# Altium schematic sheet SAMV71.SchDoc: =ProjectTitle
size B; SheetNumber: 3; SheetTotal: 5
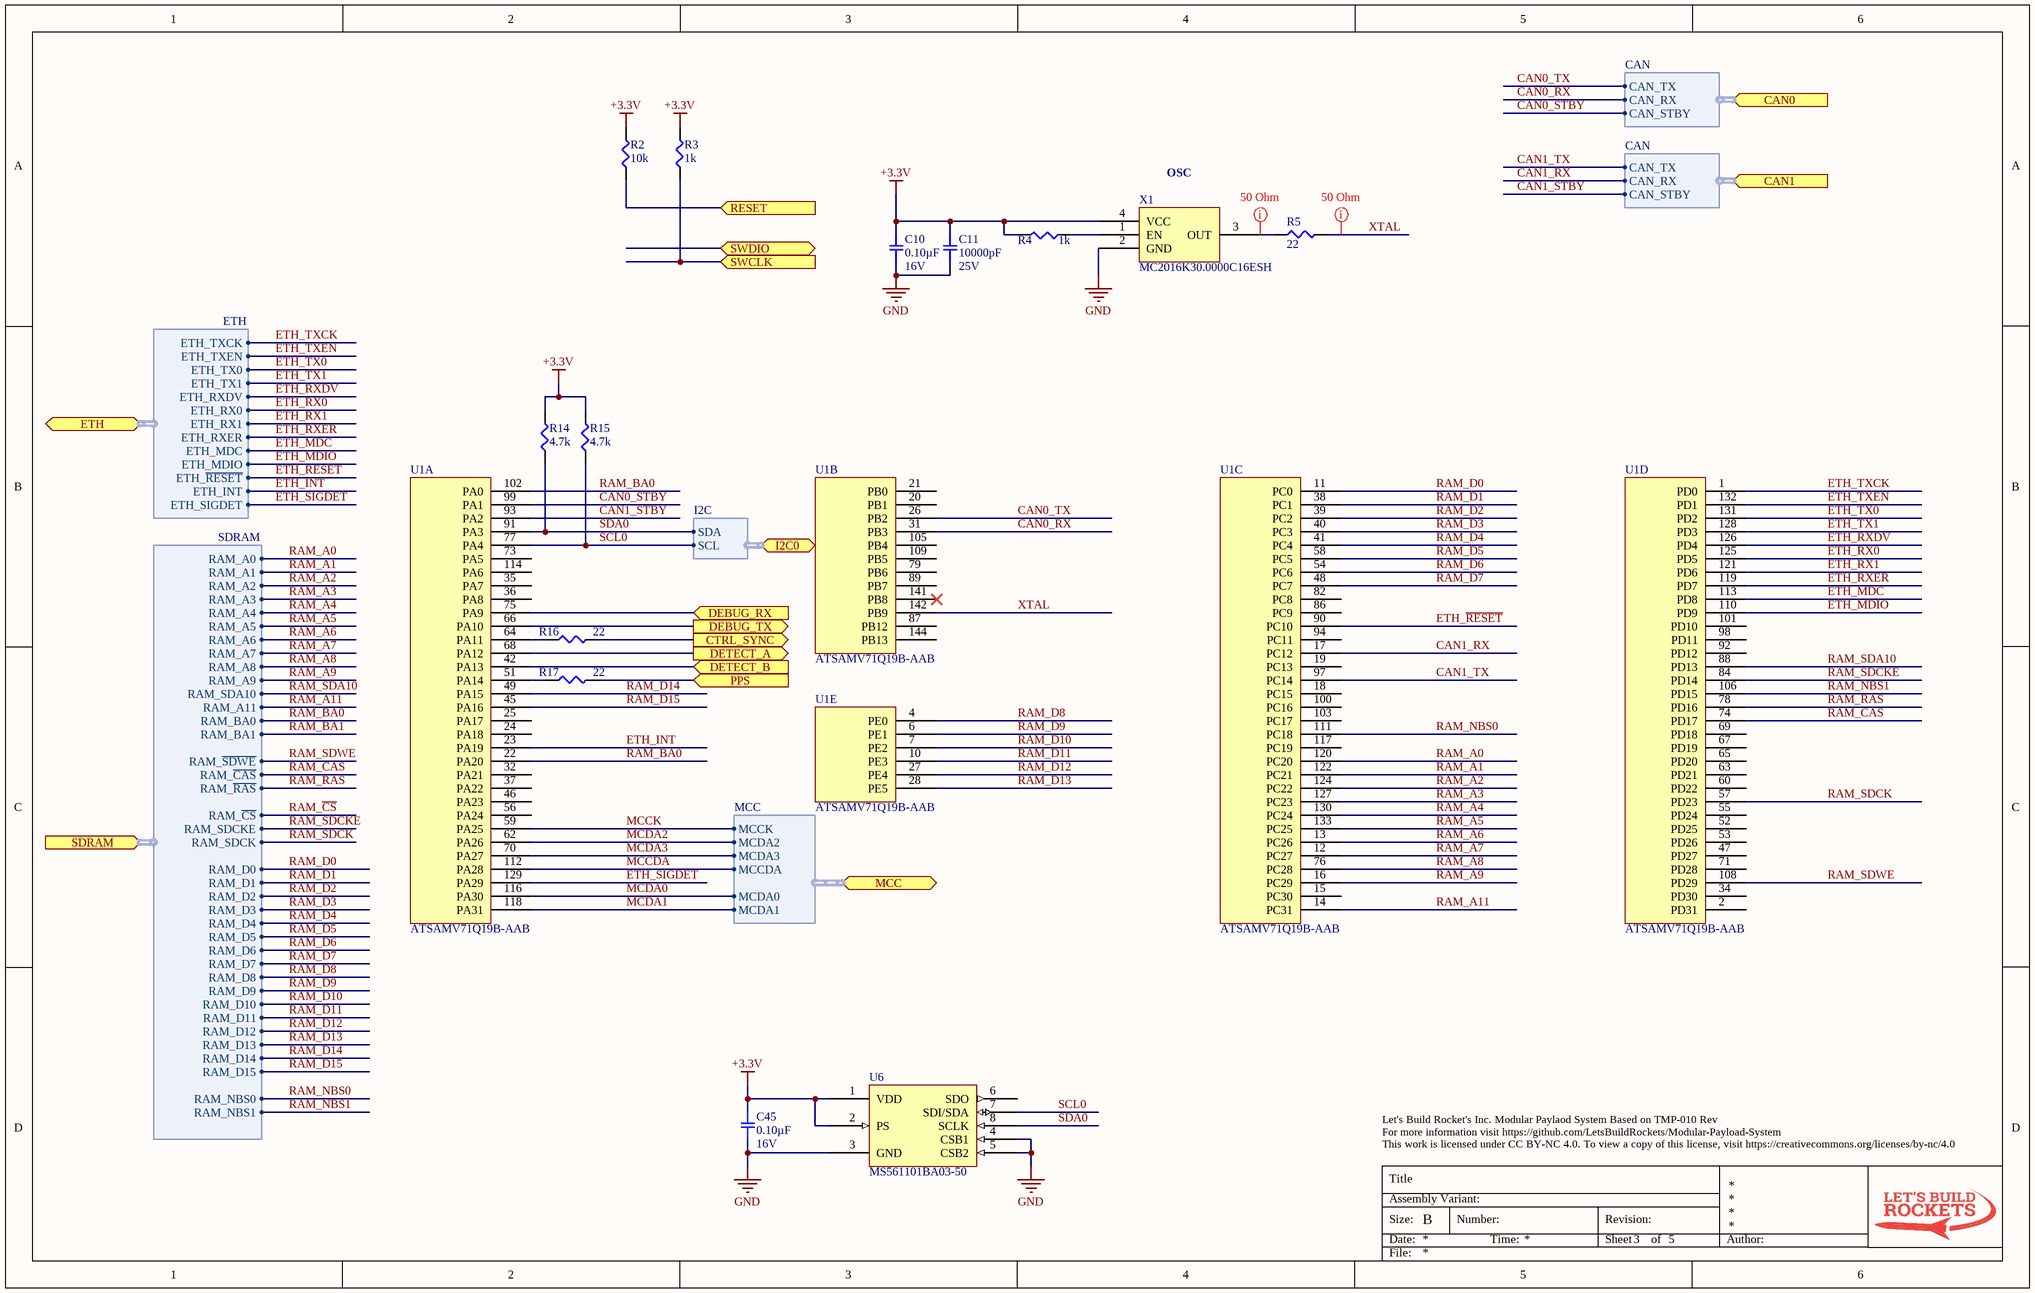
[diagram p0: SAMV71.SchDoc]

## Parts
C10  0.10µF  Voltage: 16V  [SMD-0402C]
C11  10000pF  Voltage: 25V  [SMD-0402C]
C45  0.10µF  Voltage: 16V  [SMD-0402C]
R2  10k  [SMD-0402-RES]
R3  1k  [SMD-0402-RES]
R4  1k  [SMD-0402-RES]
R5  22  [SMD-0402-RES]
R14  4.7k  [SMD-0402-RES]
R15  4.7k  [SMD-0402-RES]
R16  22  [SMD-0402-RES]
R17  22  [SMD-0402-RES]
U1  ATSAMV71Q19B-AAB  [TSQFP50P2200X2200X160-144N]  (parts A,B,C,D,E of 6)
U6  MS561101BA03-50  [MS561101BA03-50]
X1  MC2016K30.0000C16ESH  [MC2016]

## Ports
CAN0 (in, harness CAN), CAN1 (in, harness CAN), CTRL_SYNC (out), DEBUG_RX (in), DEBUG_TX (out), DETECT_A (out), DETECT_B (in), ETH (bidir, harness ETH), I2C0 (bidir, harness I2C), MCC (bidir, harness MCC), PPS (in), RESET (in), SDRAM (in, harness SDRAM), SWCLK (in), SWDIO (bidir)

## Harnesses
SDRAM: RAM_A0, RAM_A1, RAM_A2, RAM_A3, RAM_A4, RAM_A5, RAM_A6, RAM_A7, RAM_A8, RAM_A9, RAM_SDA10, RAM_A11, RAM_BA0, RAM_BA1, RAM_~{SDWE}, RAM_~{CAS}, RAM_~{RAS}, RAM_SDCKE, RAM_SDCK, RAM_~{CS}, RAM_D0, RAM_D1, RAM_D2, RAM_D3, RAM_D4, RAM_D5, RAM_D6, RAM_D7, RAM_D8, RAM_D9, RAM_D10, RAM_D11, RAM_D12, RAM_D13, RAM_D14, RAM_D15, RAM_NBS0, RAM_NBS1
CAN: CAN_TX, CAN_RX, CAN_STBY
MCC: MCCK, MCCDA, MCDA0, MCDA1, MCDA2, MCDA3
ETH: ETH_TXCK, ETH_TXEN, ETH_TX0, ETH_TX1, ETH_RXDV, ETH_RX0, ETH_RX1, ETH_RXER, ETH_MDC, ETH_MDIO, ETH_~{RESET}, ETH_INT, ETH_SIGDET
I2C: SDA, SCL

## Nets
+3.3V: C10.2 C11.2 C45.2 R2.2 R3.2 R4.2 R14.2 R15.2 U6.1(VDD) U6.2(PS) X1.4(VCC)
GND: C10.1 C11.1 C45.1 U6.3(GND) U6.4(CSB1) U6.5(CSB2) X1.2(GND)
CAN0_RX: U1.31(PB3) ; port CAN0.CAN_RX
CAN0_STBY: U1.99(PA1) ; port CAN0.CAN_STBY
CAN0_TX: U1.26(PB2) ; port CAN0.CAN_TX
CAN1_RX: U1.17(PC12) ; port CAN1.CAN_RX
CAN1_STBY: U1.93(PA2) ; port CAN1.CAN_STBY
CAN1_TX: U1.97(PC14) ; port CAN1.CAN_TX
CTRL_SYNC: R16.2 ; port CTRL_SYNC
DEBUG_RX: U1.75(PA9) ; port DEBUG_RX
DEBUG_TX: U1.66(PA10) ; port DEBUG_TX
DETECT_A: U1.68(PA12) ; port DETECT_A
DETECT_B: U1.42(PA13) ; port DETECT_B
ETH_INT: U1.23(PA19) ; port ETH.ETH_INT
ETH_MDC: U1.113(PD8) ; port ETH.ETH_MDC
ETH_MDIO: U1.110(PD9) ; port ETH.ETH_MDIO
ETH_~{RESET}: U1.90(PC10) ; port ETH.ETH_~{RESET}
ETH_RX0: U1.125(PD5) ; port ETH.ETH_RX0
ETH_RX1: U1.121(PD6) ; port ETH.ETH_RX1
ETH_RXDV: U1.126(PD4) ; port ETH.ETH_RXDV
ETH_RXER: U1.119(PD7) ; port ETH.ETH_RXER
ETH_SIGDET: U1.129(PA29) ; port ETH.ETH_SIGDET
ETH_TX0: U1.131(PD2) ; port ETH.ETH_TX0
ETH_TX1: U1.128(PD3) ; port ETH.ETH_TX1
ETH_TXCK: U1.1(PD0) ; port ETH.ETH_TXCK
ETH_TXEN: U1.132(PD1) ; port ETH.ETH_TXEN
MCCDA: U1.112(PA28) ; port MCC.MCCDA
MCCK: U1.59(PA25) ; port MCC.MCCK
MCDA0: U1.116(PA30) ; port MCC.MCDA0
MCDA1: U1.118(PA31) ; port MCC.MCDA1
MCDA2: U1.62(PA26) ; port MCC.MCDA2
MCDA3: U1.70(PA27) ; port MCC.MCDA3
PPS: R17.2 ; port PPS
RAM_A0: U1.120(PC20) ; port SDRAM.RAM_A0
RAM_A1: U1.122(PC21) ; port SDRAM.RAM_A1
RAM_A2: U1.124(PC22) ; port SDRAM.RAM_A2
RAM_A3: U1.127(PC23) ; port SDRAM.RAM_A3
RAM_A4: U1.130(PC24) ; port SDRAM.RAM_A4
RAM_A5: U1.133(PC25) ; port SDRAM.RAM_A5
RAM_A6: U1.13(PC26) ; port SDRAM.RAM_A6
RAM_A7: U1.12(PC27) ; port SDRAM.RAM_A7
RAM_A8: U1.76(PC28) ; port SDRAM.RAM_A8
RAM_A9: U1.16(PC29) ; port SDRAM.RAM_A9
RAM_A11: U1.14(PC31) ; port SDRAM.RAM_A11
RAM_BA0: U1.22(PA20) U1.102(PA0) ; port SDRAM.RAM_BA0
RAM_BA1: port SDRAM.RAM_BA1
RAM_~{CS}: port SDRAM.RAM_~{CS}
RAM_CAS: U1.74(PD17) ; port SDRAM.RAM_~{CAS}
RAM_D0: U1.11(PC0) ; port SDRAM.RAM_D0
RAM_D1: U1.38(PC1) ; port SDRAM.RAM_D1
RAM_D2: U1.39(PC2) ; port SDRAM.RAM_D2
RAM_D3: U1.40(PC3) ; port SDRAM.RAM_D3
RAM_D4: U1.41(PC4) ; port SDRAM.RAM_D4
RAM_D5: U1.58(PC5) ; port SDRAM.RAM_D5
RAM_D6: U1.54(PC6) ; port SDRAM.RAM_D6
RAM_D7: U1.48(PC7) ; port SDRAM.RAM_D7
RAM_D8: U1.4(PE0) ; port SDRAM.RAM_D8
RAM_D9: U1.6(PE1) ; port SDRAM.RAM_D9
RAM_D10: U1.7(PE2) ; port SDRAM.RAM_D10
RAM_D11: U1.10(PE3) ; port SDRAM.RAM_D11
RAM_D12: U1.27(PE4) ; port SDRAM.RAM_D12
RAM_D13: U1.28(PE5) ; port SDRAM.RAM_D13
RAM_D14: U1.49(PA15) ; port SDRAM.RAM_D14
RAM_D15: U1.45(PA16) ; port SDRAM.RAM_D15
RAM_NBS0: U1.111(PC18) ; port SDRAM.RAM_NBS0
RAM_NBS1: U1.106(PD15) ; port SDRAM.RAM_NBS1
RAM_RAS: U1.78(PD16) ; port SDRAM.RAM_~{RAS}
RAM_SDA10: U1.88(PD13) ; port SDRAM.RAM_SDA10
RAM_SDCK: U1.57(PD23) ; port SDRAM.RAM_SDCK
RAM_SDCKE: U1.84(PD14) ; port SDRAM.RAM_SDCKE
RAM_SDWE: U1.108(PD29) ; port SDRAM.RAM_~{SDWE}
RESET: R2.1 ; port RESET
SCL0: R15.1 U1.77(PA4) U6.7(SDI/SDA) ; port I2C0.SCL
SDA0: R14.1 U1.91(PA3) U6.8(SCLK) ; port I2C0.SDA
SWCLK: R3.1 ; port SWCLK
XTAL: R5.2 U1.142(PB9)
NetR4_1: R4.1 X1.1(EN)
NetR5_1: R5.1 X1.3(OUT)
NetR16_1: R16.1 U1.64(PA11)
NetR17_1: R17.1 U1.51(PA14)

Not connected (* = marked no-connect by the designer): U1 2(PD31) 15(PC30) 18(PC15) 19(PC13) 20(PB1) 21(PB0) 24(PA18) 25(PA17) 32(PA21) 34(PD30) 35(PA7) 36(PA8) 37(PA22) 46(PA23) 47(PD27) 52(PD25) 53(PD26) 55(PD24) 56(PA24) 60(PD22) 63(PD21) 65(PD20) 67(PD19) 69(PD18) 71(PD28) 73(PA5) 79(PB6) 82(PC8) 86(PC9) 87(PB12) 89(PB7) 92(PD12) 94(PC11) 98(PD11) 100(PC16) 101(PD10) 103(PC17) 105(PB4) 109(PB5) 114(PA6) 117(PC19) 141(PB8)* 144(PB13); U6 6(SDO)

## Layout directives
rule Width Constraint [Pref Impedance = 50.00ohms    Min Impedance = 50.00ohms    Max Impedance = 50.00ohms]: NetR5_1, XTAL

## Notes on the sheet
- (near X1) OSC
- Let's Build Rocket's Inc. Modular Paylaod System Based on TMP-010 Rev
  For more information visit https://github.com/LetsBuildRockets/Modular-Payload-System
  This work is licensed under CC BY-NC 4.0. To view a copy of this license, visit https://creativecommons.org/licenses/by-nc/4.0
- Title
- Size:
- Date:
- Assembly Variant:
- B
- Number:
- Time:
- Revision:
- Sheet
- of
- Author:
- File:

## Library data of the parts
C10 C45 = GCM155R71C104KA55D: CAP CER 0.1UF 16V X7R 0402; Manufacturer: Murata Electronics North America; Factory Stock: 0; Unit Price (USD): 0.1; Minimum Quantity: 1; Tolerance: ±10%; Datasheets: http://www.murata.com/~/media/webrenewal/support/library/catalog/products/capacitor/mlcc/c03e.ashx; Image: //media.digikey.com/Renders/Murata%20Renders/ZRB-SERIES-0402.jpg; Digi-Key Part Number: 490-4759-1-ND; Part Number: GCM155R71C104KA55D; Quantity Available: 734194; @ qty: 0; Packaging: Cut Tape (CT); Series: GCM; Part Status: Active; Value: 0.10µF; Temperature Coefficient: X7R; Operating Temperature: -55°C ~ 125°C; Features: -; Ratings: AEC-Q200; Applications: Automotive; Mounting Type: Surface Mount, MLCC; Package / Case: 0402 (1005 Metric); Size / Dimension: 0.039" L x 0.020" W (1.00mm x 0.50mm); Height - Seated (Max): -; Thickness (Max): 0.022" (0.55mm); Lead Spacing: -; Lead Style: -
C11 = GCM155R71E103KA37D: CAP CER 10000PF 25V X7R 0402; Manufacturer: Murata Electronics North America; Factory Stock: 0; Unit Price (USD): 0.1; Minimum Quantity: 1; Tolerance: ±10%; Datasheets: http://www.murata.com/~/media/webrenewal/support/library/catalog/products/capacitor/mlcc/c03e.ashx; Image: //media.digikey.com/Renders/Murata%20Renders/ZRB-SERIES-0402.jpg; Digi-Key Part Number: 490-6043-1-ND; Part Number: GCM155R71E103KA37D; Quantity Available: 128782; @ qty: 0; Packaging: Cut Tape (CT); Series: GCM; Part Status: Active; Value: 10000pF; Temperature Coefficient: X7R; Operating Temperature: -55°C ~ 125°C; Features: -; Ratings: AEC-Q200; Applications: Automotive; Mounting Type: Surface Mount, MLCC; Package / Case: 0402 (1005 Metric); Size / Dimension: 0.039" L x 0.020" W (1.00mm x 0.50mm); Height - Seated (Max): -; Thickness (Max): 0.022" (0.55mm); Lead Spacing: -; Lead Style: -
R2 = ERJ-2GEJ103X: RES SMD 10K OHM 5% 1/10W 0402; Manufacturer: Panasonic Electronic Components; Factory Stock: 0; Unit Price (USD): 0.00350; @ qty: 1500; Minimum Quantity: 1; Power (Watts): 0.1W, 1/10W; Temperature Coefficient: ±200ppm/°C; Part Number: ERJ-2GEJ103X; Datasheets: http://industrial.panasonic.com/www-cgi/jvcr13pz.cgi?E+PZ+3+AOA0001+ERJ2GEJ103X+7+WW; Image: //media.digikey.com/Photos/Panasonic%20Photos/ERJ-PA2-Series.jpg; Digi-Key Part Number: P10KJCT-ND; Quantity Available: 2560215; Packaging: Cut Tape (CT); Series: ERJ; Part Status: Active; Value: 10k; Tolerance: ±5%; Composition: Thick Film; Features: Automotive AEC-Q200; Operating Temperature: -55°C ~ 155°C; Package / Case: 0402 (1005 Metric); Supplier Device Package: 0402; Size / Dimension: 0.039" L x 0.020" W (1.00mm x 0.50mm); Height - Seated (Max): 0.016" (0.40mm); Number of Terminations: 2; Failure Rate: -
R3 R4 = ERJ-2GEJ102X: RES SMD 1K OHM 5% 1/10W 0402; Manufacturer: Panasonic Electronic Components; Factory Stock: 0; Unit Price (USD): 0.00350; @ qty: 1500; Minimum Quantity: 1; Power (Watts): 0.1W, 1/10W; Temperature Coefficient: ±200ppm/°C; Part Number: ERJ-2GEJ102X; Datasheets: http://industrial.panasonic.com/www-cgi/jvcr13pz.cgi?E+PZ+3+AOA0001+ERJ2GEJ102X+7+WW; Image: //media.digikey.com/Photos/Panasonic%20Photos/ERJ-PA2-Series.jpg; Digi-Key Part Number: P1.0KJCT-ND; Quantity Available: 1939857; Packaging: Cut Tape (CT); Series: ERJ; Part Status: Active; Value: 1k; Tolerance: ±5%; Composition: Thick Film; Features: Automotive AEC-Q200; Operating Temperature: -55°C ~ 155°C; Package / Case: 0402 (1005 Metric); Supplier Device Package: 0402; Size / Dimension: 0.039" L x 0.020" W (1.00mm x 0.50mm); Height - Seated (Max): 0.016" (0.40mm); Number of Terminations: 2; Failure Rate: -
R5 R16 R17 = ERJ-2RKF22R0X: RES SMD 22 OHM 1% 1/10W 0402; Manufacturer: Panasonic Electronic Components; Factory Stock: 0; Unit Price (USD): 0.00496; @ qty: 1500; Minimum Quantity: 1; Power (Watts): 0.1W, 1/10W; Temperature Coefficient: ±100ppm/°C; Part Number: ERJ-2RKF22R0X; Datasheets: http://industrial.panasonic.com/www-cgi/jvcr13pz.cgi?E+PZ+3+AOA0002+ERJ2RKF22R0X+7+WW; Image: //media.digikey.com/Photos/Panasonic%20Photos/ERJ-PA2-Series.jpg; Digi-Key Part Number: P22.0LCT-ND; Quantity Available: 620432; Packaging: Cut Tape (CT); Series: ERJ; Part Status: Active; Value: 22; Tolerance: ±1%; Composition: Thick Film; Features: Automotive AEC-Q200; Operating Temperature: -55°C ~ 155°C; Package / Case: 0402 (1005 Metric); Supplier Device Package: 0402; Size / Dimension: 0.039" L x 0.020" W (1.00mm x 0.50mm); Height - Seated (Max): 0.016" (0.40mm); Number of Terminations: 2; Failure Rate: -
R14 R15 = ERJ-2GEJ472X: RES SMD 4.7K OHM 5% 1/10W 0402; Manufacturer: Panasonic Electronic Components; Factory Stock: 0; Unit Price (USD): 0.00350; @ qty: 1500; Minimum Quantity: 1; Power (Watts): 0.1W, 1/10W; Temperature Coefficient: ±200ppm/°C; Part Number: ERJ-2GEJ472X; Datasheets: http://industrial.panasonic.com/www-cgi/jvcr13pz.cgi?E+PZ+3+AOA0001+ERJ2GEJ472X+7+WW; Image: //media.digikey.com/Photos/Panasonic%20Photos/ERJ-PA2-Series.jpg; Digi-Key Part Number: P4.7KJCT-ND; Quantity Available: 8551774; Packaging: Cut Tape (CT); Series: ERJ; Part Status: Active; Value: 4.7k; Tolerance: ±5%; Composition: Thick Film; Features: Automotive AEC-Q200; Operating Temperature: -55°C ~ 155°C; Package / Case: 0402 (1005 Metric); Supplier Device Package: 0402; Size / Dimension: 0.039" L x 0.020" W (1.00mm x 0.50mm); Height - Seated (Max): 0.016" (0.40mm); Number of Terminations: 2; Failure Rate: -
U1 = ATSAMV71Q19B-AAB: Unit Price (USD): 10.74
U6 = MS561101BA03-50: Unit Price (USD): 12.22
X1 = MC2016K30.0000C16ESH: Unit Price (USD): 2.37